# EAGLE design or (EAGLE 9.6.2)
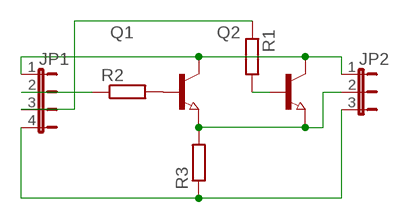
[diagram p0: schematic, sheet 1]

## Parts
JP1  JP4E  [JP4]
JP2  JP2W  [JP2W]
Q1  NPN-TRANSISTOR_SOT23  [SOT23]
Q2  NPN-TRANSISTOR_SOT23  [SOT23]
R1  R-EU_R1206  [R1206]
R2  R-EU_R1206  [R1206]
R3  R-EU_R1206  [R1206]

## Nets
N$1: Q2.1(B) R1.2
N$2: Q1.1(B) R2.2
N$3: JP2.2 Q1.2(E) Q2.2(E) R3.2
N$4: JP1.4 JP2.3 R3.1
N$5: JP1.1 JP2.1 Q1.3(C) Q2.3(C)
N$6: JP1.2 R2.1
N$7: JP1.3 R1.1

## Library data of the parts
JP1 = jumper:JP4E: JUMPER
JP2 = jumper:JP2W: JUMPER
Q1 Q2 = semicon-smd-ipc:NPN-TRANSISTOR_: NPN TRANSISTOR
R1-R3 = rcl:R-EU_: RESISTOR, European symbol; SPICEPREFIX: R

## Net classes
0 default: width 1.27 mm

## Board
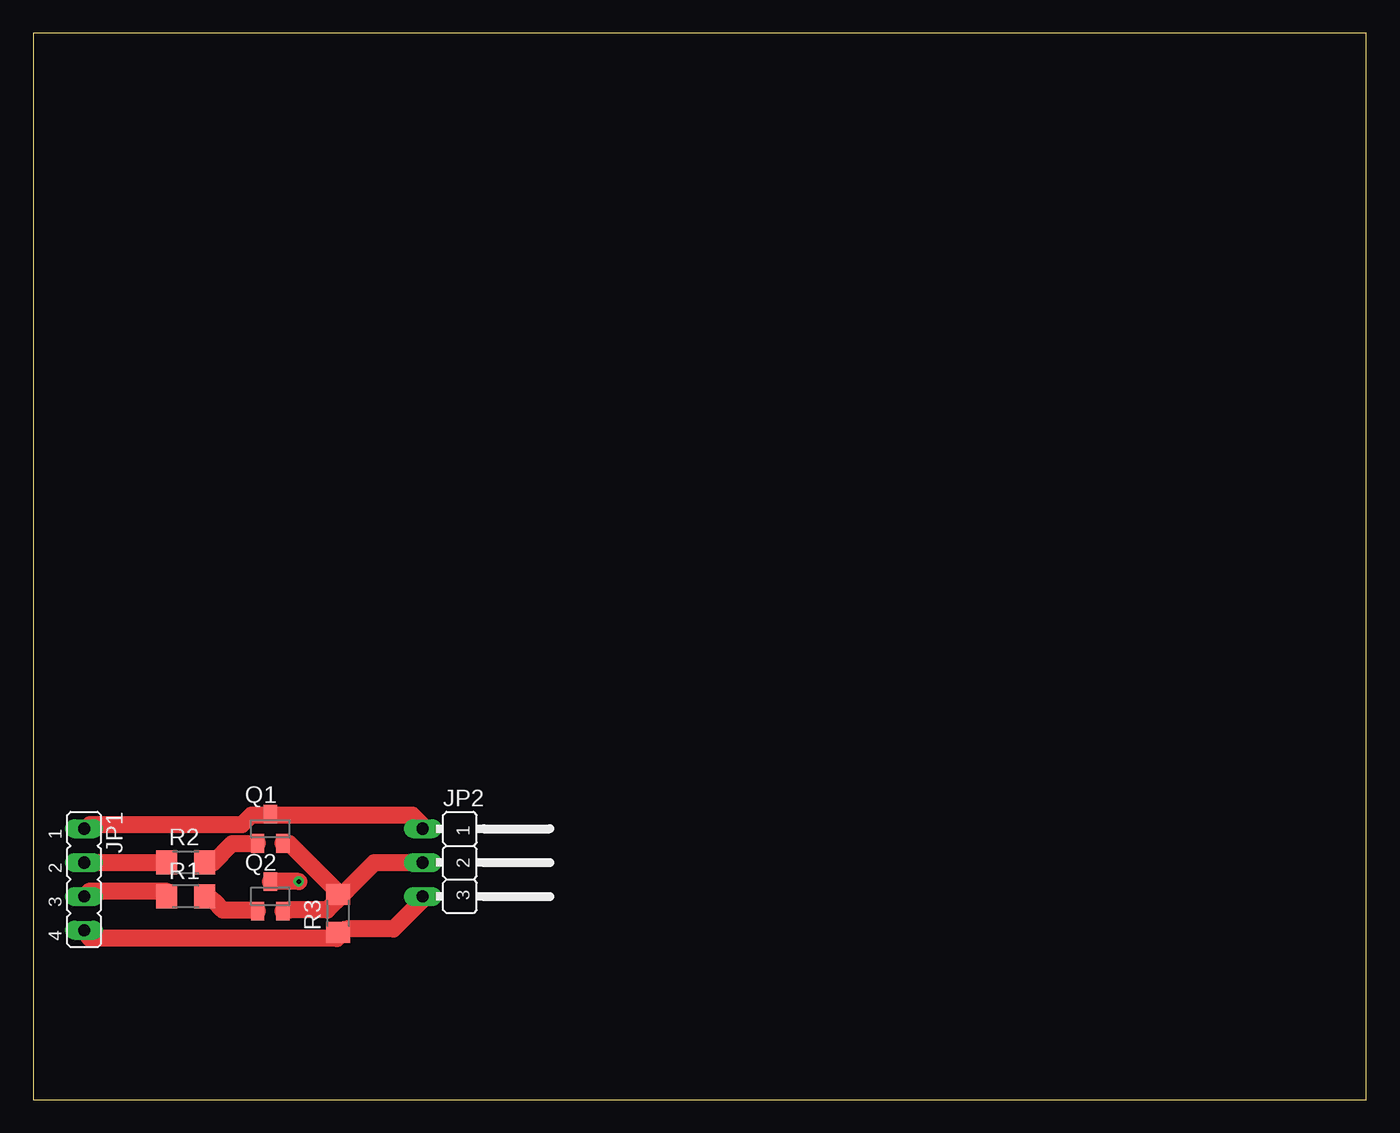
[diagram p1: board, top side]
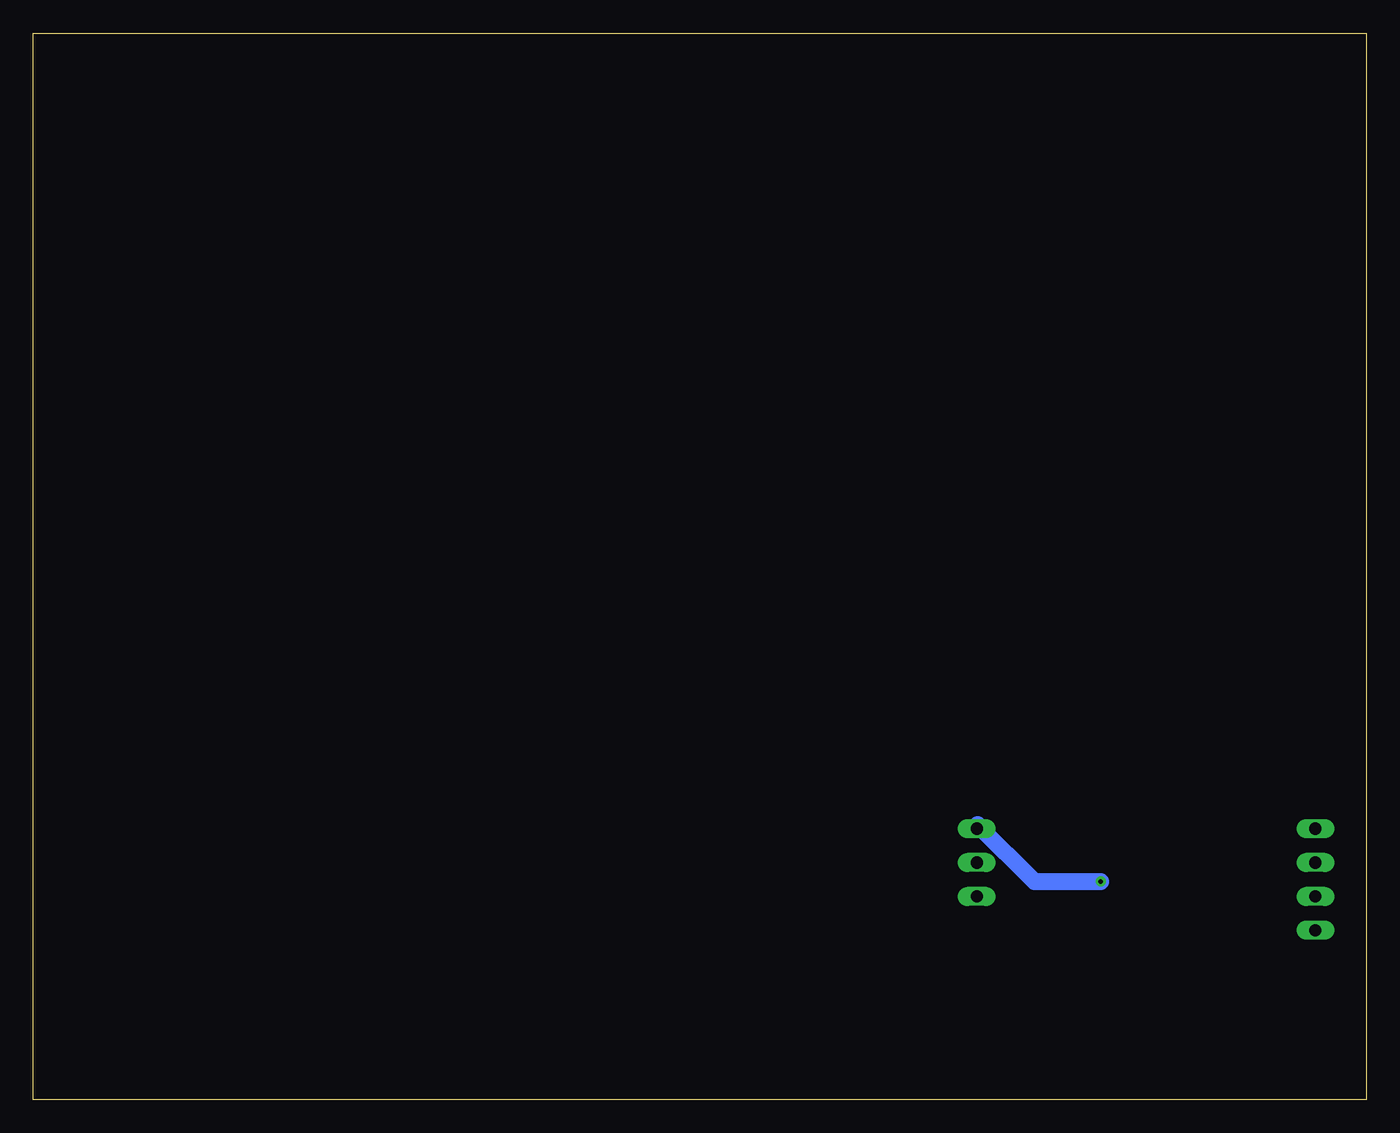
[diagram p2: board, bottom side, seen from below]

Size 100 x 80 mm. Coordinates in mm from the lower left corner, seen from the top.
Outline: 0,0 100,0 100,80 0,80 0,0
Copper layers (1*16): Top 0.035mm / dielectric 1.5mm / Bottom 0.035mm
Design rules "default": minimum track width 6mil, minimum drill 0.35mm, track to track 6mil, track to pad 6mil, pad to pad 6mil, via to via 6mil, smd to smd 6mil, copper to edge 40mil, drill to drill 6mil, minimum pad ring 10mil, minimum via ring 8mil, stop-mask expansion 4mil, vias tented up to drill 0mil, thermal gap 10mil

### Footprints (pad centres in the part's own frame; a part is rotated, then mirrored left to right if it is on the bottom)
JP4 = drill 0.914 long: 1 -3.81,0; 2 -1.27,0; 3 1.27,0; 4 3.81,0
JP2W = drill 0.914 long: 1 -2.54,-1.27; 2 0,-1.27; 3 2.54,-1.27
SOT23 = smd 1 x 1.4: 1 -0.95,-1.1; 2 0.95,-1.1; 3 0,1.1
R1206 = smd 1.6 x 1.803: 1 -1.422,0; 2 1.422,0

### Placement (x,y rotation side)
JP1  3.81,16.51 270 top
JP2  30.48,17.78 270 top
Q1  17.78,20.32 0 top
Q2  17.78,15.24 0 top
R1  11.43,15.24 0 top
R2  11.43,17.78 0 top
R3  22.86,13.97 90 top

### Tracks (layer width: path | path; a pad name or v marks a point on that pad's centre or on a via)
N$1
  Top 1.27: Q2.1 16.36,14.22 14.22,14.22 13.51,14.94 R1.2
N$2
  Top 1.27: Q1.1 16.36,19.2 14.94,19.2 13.51,17.78 R2.2
N$3
  Top 1.27: Q2.2 19.2,14.22 22.05,14.22 22.76,14.94 R3.2 | Q1.2 19.2,19.2 22.76,15.65 R3.2 | JP2.2 25.6,17.78 23.47,15.65 R3.2
N$4
  Top 1.27: JP2.3 29.16,14.94 27.03,12.8 23.47,12.8 R3.1 22.76,12.09 4.27,12.09 JP1.4
N$5  (via drill 0.35)
  Top 1.27: v19.91,16.36 17.78,16.36 Q2.3 | 17.78,21.34 28.45,21.34 29.16,20.62 JP2.1 | 17.78,21.34 16.36,21.34 15.65,20.62 4.27,20.62 JP1.1 | 17.78,21.34 Q1.3
  Bottom 1.27: v19.91,16.36 24.89,16.36 29.16,20.62 JP2.1
N$6
  Top 1.27: JP1.2 R2.1
N$7
  Top 1.27: R1.1 9.96,15.65 4.27,15.65 JP1.3